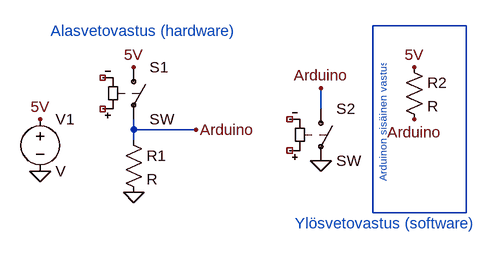
[diagram p0: schematic iot-projekti-up-down-resistor.asc]
iot-projekti-up-down-resistor.asc, the LTspice schematic file:
Version 4
SHEET 1 880 680
WIRE 656 -128 512 -128
WIRE 432 0 432 -32
WIRE 144 32 144 16
WIRE 240 32 144 32
WIRE 144 48 144 32
WIRE 512 160 512 -128
WIRE 656 160 656 -128
WIRE 656 160 512 160
FLAG 0 16 5V
FLAG 144 -64 5V
FLAG 576 -64 5V
FLAG 576 16 Arduino
FLAG 432 -32 Arduino
FLAG 240 32 Arduino
FLAG 0 96 0
FLAG 144 128 0
FLAG 432 80 0
SYMBOL voltage 0 0 R0
SYMATTR InstName V1
SYMBOL sw 144 -80 R0
SYMATTR InstName S1
SYMBOL sw 432 -16 R0
SYMATTR InstName S2
SYMBOL res 128 32 R0
SYMATTR InstName R1
SYMBOL res 560 -80 R0
SYMATTR InstName R2
TEXT 16 -120 Left 2 ;Alasvetovastus (hardware)
TEXT 392 176 Left 2 ;Ylösvetovastus (software)
TEXT 528 112 VLeft 1 ;Arduinon sisäinen vastus

The netlist it stands for:
* iot-projekti-up-down-resistor.asc
V1 5V 0 V
S1 5V Arduino NC_01 NC_02 SW
S2 Arduino 0 NC_03 NC_04 SW
R1 Arduino 0 R
R2 5V Arduino R
* Alasvetovastus (hardware)
* Ylösvetovastus (software)
* Arduinon sisäinen vastus
.backanno
.end